# EAGLE design Enviro (EAGLE 9.6.2)
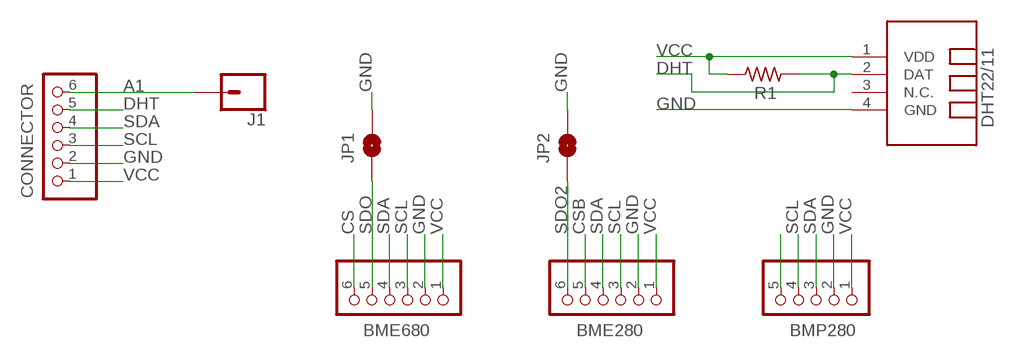
[diagram p0: schematic, sheet 1]

## Parts
BME280  PINHD-1X6  [1X06]
BME680  PINHD-1X6  [1X06]
BMP280  PINHD-1X5  [1X05]
CONNECTOR  PINHD-1X6  [1X06]
J1  CONN_01PTH_LONGPAD  [1X01_LONGPAD]
JP1  JUMPER-SMT_2_NO_SILK  [SMT-JUMPER_2_NO_SILK]
JP2  JUMPER-SMT_2_NO_SILK  [SMT-JUMPER_2_NO_SILK]
R1  R-US_R1206  [R1206]
U$1  DHT22/11  TEMP-HUM-SENSOR-DHT22  [TEMP-HUM-SENSOR-DHT22]

## Nets
A1: CONNECTOR.6 J1.1
CS: BME680.6
CSB: BME280.5
DHT: CONNECTOR.5 R1.2 U$1.2(DAT)
GND: BME280.2 BME680.2 BMP280.2 CONNECTOR.2 JP1.2 JP2.2 U$1.4(GND)
N$18: BMP280.5
SCL: BME280.3 BME680.3 BMP280.4 CONNECTOR.3
SDA: BME280.4 BME680.4 BMP280.3 CONNECTOR.4
SDO: BME680.5 JP1.1
SDO2: BME280.6 JP2.1
VCC: BME280.1 BME680.1 BMP280.1 CONNECTOR.1 R1.1 U$1.1(VDD)
Unconnected: U$1.3(N.C.)

## Library data of the parts
BME280 BME680 CONNECTOR = pinhead:PINHD-1X6: PIN HEADER
BMP280 = pinhead:PINHD-1X5: PIN HEADER
J1 = SparkFun-Connectors:CONN_01: Single connection point. Often used as Generic Header-pin footprint for 0.1 inch spaced/style header connections On any of the 0.1 inch spaced packages, you can populate with these: Break Away Headers - Straight <https://www.sparkfun.com/products/116> (PRT-00116) Break Away Male Headers - Right Angle <https://www.sparkfun.com/products/553> (PRT-00553) Female Headers <https://www.sparkfun.com/products/115> (PRT-00115) Break Away Headers - Machine Pin <https://www.sparkfun.com/products/117> (PRT-00117) Break Away Female Headers - Swiss Machine Pin <https://www.sparkfun.com/products/743> (PRT-00743) This device is also useful as a general connection point to wire up your design to another part of your project. Our various solder wires solder well into these plated through hole pads. Hook-Up Wire - Assortment (Stranded, 22 AWG) <https://www.sparkfun.com/products/11375> (PRT-11375) Hook-Up Wire - Assortment (Solid Core, 22 AWG) <https://www.sparkfun.com/products/11367> (PRT-11367) View the entire wire category on our website here <https://www.sparkfun.com/categories/141> Special notes: SMTSO-256-ET is a "flush mount" nut for a 4-40 screw. We mostly use this on specialty testbeds; it is a nice way to connect hardware to your PCB at an adjustable hieght. Also note, the SNAP packages are for using a snappable style connector. We sell a baggie of snaps and they are also used on two LilyPad designs: Snap Assortment - 30 pack (male and female) <https://www.sparkfun.com/products/11347> (DEV-11347) LilyPad Arduino SimpleSnap <https://www.sparkfun.com/products/10941> (DEV-10941) LilyPad SimpleSnap Protoboard <https://www.sparkfun.com/products/10940> (DEV-10940)
JP1 JP2 = SparkFun-Jumpers:JUMPER-SMT_2_NO: Normally open jumper This jumper has two pads in close proximity to each other. Apply solder to close the connection. Round pads are easier to solder for beginners, but are a lot larger. SparkFun Product that uses the round pads: SparkFun EL Sequencer <https://www.sparkfun.com/products/12781>
R1 = rcl:R-US_: RESISTOR, American symbol; SPICEPREFIX: R
U$1 = diy-modules:TEMP-HUM-SENSOR-DHT22: DHT22 - digital humidity & temperature sensor Also known as: AM2302 AM2302 datasheet available here: http://akizukidenshi.com/download/ds/aosong/AM2302.pdf Click here to find device on ebay.com <http://www.ebay.com/sch/dht22+digital+sensor>

## Board
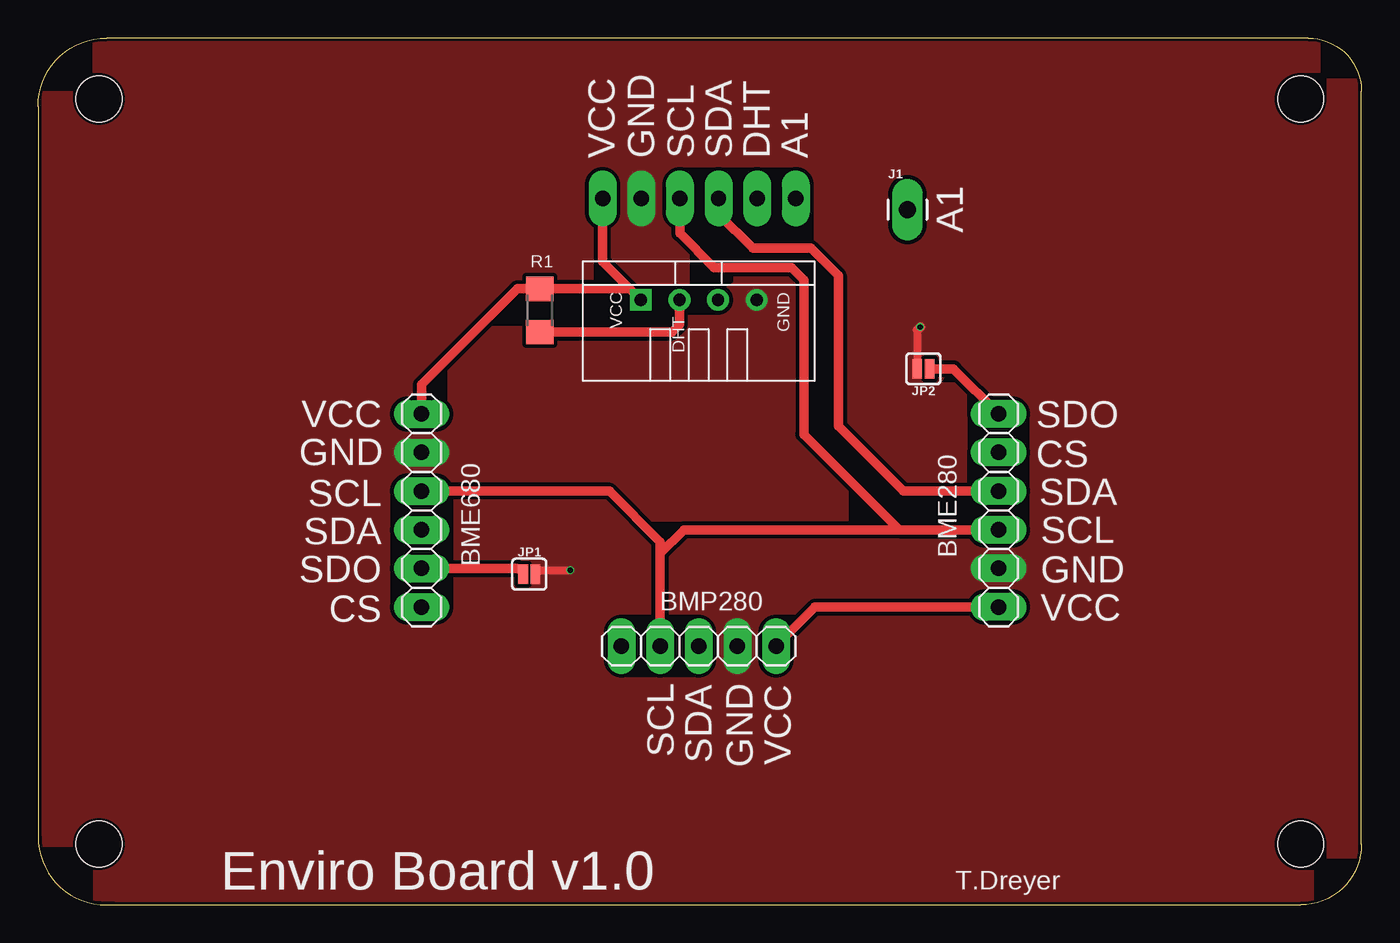
[diagram p1: board, top side]
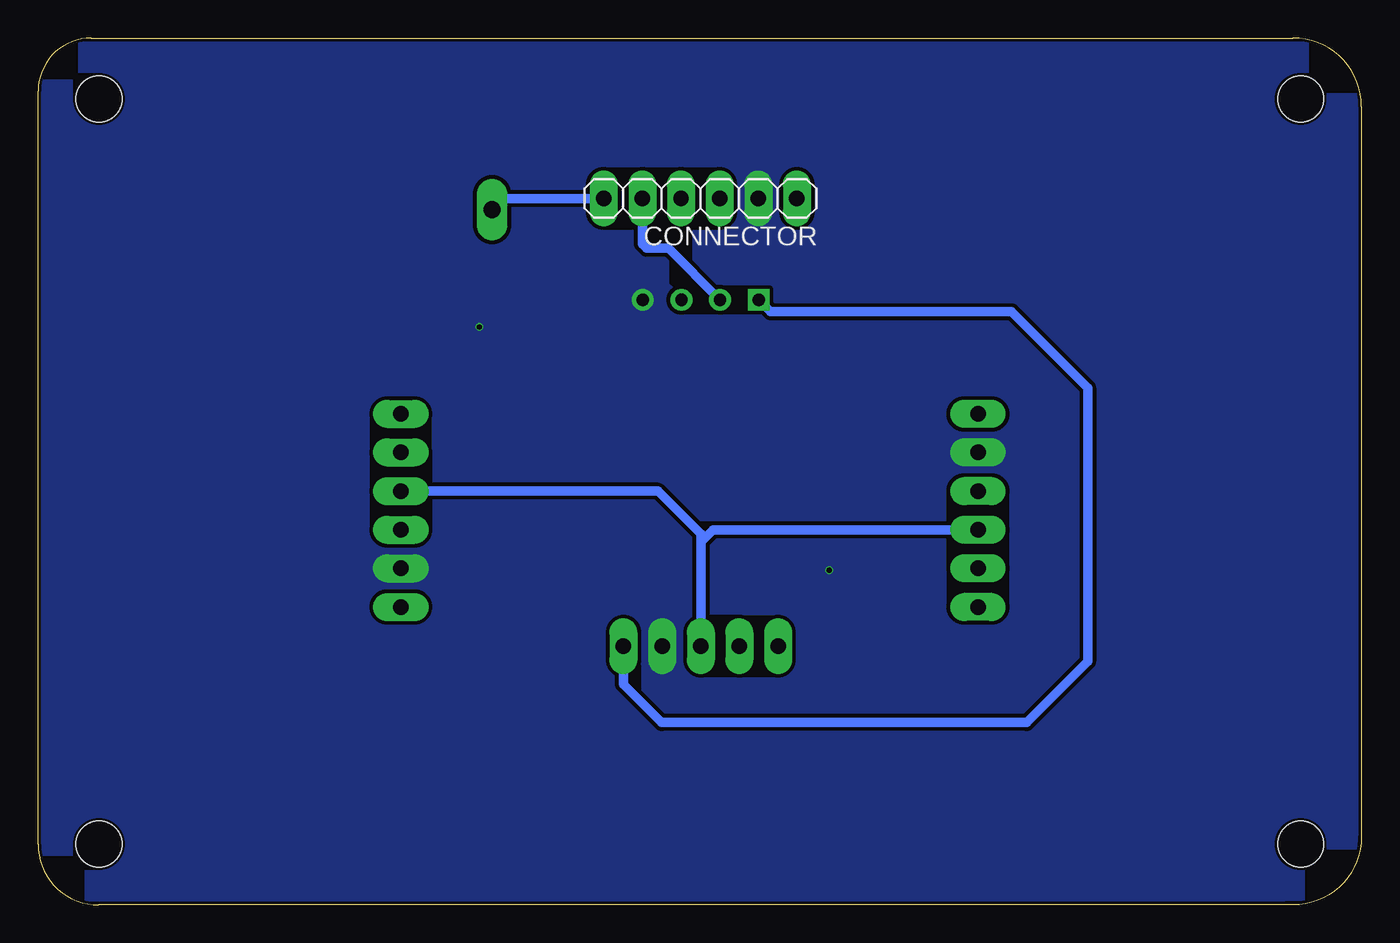
[diagram p2: board, bottom side, seen from below]

Size 87 x 57 mm. Coordinates in mm from the lower left corner, seen from the top.
Outline: 5,0 83,0 arc90 87,4 87,53.5 arc90 83.5,57 4.5,57 arc90 0,52.5 0,4.5 arc90 4.5,0 5,0
Copper layers (1*16): Top 0.035mm / dielectric 1.6mm / Bottom 0.035mm
Design rules "jlcpcb-2layers *": minimum track width 5mil, minimum drill 0.3mm, track to track 10mil, track to pad 5mil, pad to pad 5mil, via to via 5mil, smd to smd 5mil, copper to edge 0.2mm, drill to drill 6mil, minimum pad ring 10mil, minimum via ring 3mil, stop-mask expansion 4mil, vias tented up to drill 16mil, thermal gap 10mil
Holes 3 mm at 4,53 4,4 83,4 83,53

### Footprints (pad centres in the part's own frame; a part is rotated, then mirrored left to right if it is on the bottom)
1X06 = drill 1.016 long: 1 -6.35,0; 2 -3.81,0; 3 -1.27,0; 4 1.27,0; 5 3.81,0; 6 6.35,0
1X05 = drill 1.016 long: 1 -5.08,0; 2 -2.54,0; 3 0,0; 4 2.54,0; 5 5.08,0
1X01_LONGPAD = drill 1.118 pad 1.88 long: 1 0,0
SMT-JUMPER_2_NO_SILK = smd 0.635 x 1.27: 1 -0.406,0; 2 0.406,0
R1206 = smd 1.6 x 1.803: 1 -1.422,0; 2 1.422,0
TEMP-HUM-SENSOR-DHT22 = drill 0.8 square: 1 -3.81,0 | drill 0.8: 2 -1.27,0; 3 1.27,0; 4 3.81,0

### Placement (x,y rotation side)
BME280  63.15,25.94 90 top
BME680  25.21,25.94 270 top
BMP280  43.43,17.02 180 top
CONNECTOR  43.46,46.45 180 bottom
J1  57.15,45.72 0 top
JP1  32.29,21.75 0 top
JP2  58.2,35.25 180 top
R1  32.98,39.09 270 top
U$1  43.43,39.78 0 top

### Tracks (layer width: path | path; a pad name or v marks a point on that pad's centre or on a via)
A1
  Bottom 0.61: CONNECTOR.6 56.42,46.45 J1.1
DHT
  Top 0.61: R1.2 41.67,37.67 42.16,38.16 U$1.2
  Bottom 0.61: U$1.2 45.56,43.18 46.99,43.18 47.27,43.46 CONNECTOR.5
GND  (via drill 0.35)
  Top 0.508: JP2.2 57.79,37.79 | 32.95,22 v35,22
  Top 0.61: 57.79,37.79 v58,38 | JP1.2 32.95,22
  pour Top: -9,61 -9,-6 -4,-6 91,-6 91,59 91,61
  pour Bottom: -17,68 -17,-12 100,-12 100,68
SCL
  Top 0.61: BME680.3 37.56,27.21 40.89,23.88 BMP280.4 40.89,23.11 42.45,24.67 BME280.3 56.61,24.67 50.34,30.94 50.34,41.1 49.53,41.91 44.45,41.91 42.19,44.17 CONNECTOR.3
SDA
  Top 0.61: BME280.4 56.88,27.21 52.61,31.48 52.61,41.37 50.8,43.18 46.99,43.18 44.73,45.44 CONNECTOR.4
  Bottom 0.61: BME680.4 42.64,24.67 43.43,23.88 BMP280.3 43.43,24.38 46.26,27.21 BME280.4
SDO
  Top 0.508: 31.5,22.13 JP1.1
  Top 0.61: BME680.5 31.5,22.13
SDO2
  Top 0.61: BME280.6 60.19,35.25 JP2.1
VCC
  Top 0.61: BMP280.1 51.09,19.59 BME280.1 | CONNECTOR.1 37.11,42.29 U$1.1 38.9,40.51 R1.1 31.51,40.51 25.21,34.21 BME680.1
  Bottom 0.61: U$1.1 38.84,39 23,39 18,34 18,16 22,12 46,12 48.51,14.51 BMP280.1

### Text on the board
tPlace: VCC | GND | SCL | SDA | DHT | A1 | A1 | VCC | GND | DHT | VCC | GND | SDO | CS | SCL | SDA | SDA | SCL | SDO | GND | CS | VCC | SCL | GND | SDA | VCC | Enviro Board v1.0 | T.Dreyer
200bmp: C:/Users/tfd04/Desktop/Gecko Boards.bmp